# EAGLE design loki_mod (EAGLE 6.6.0)
Pulsar P3 Replacement Module 'Odin' made by Roy Schneider 2020
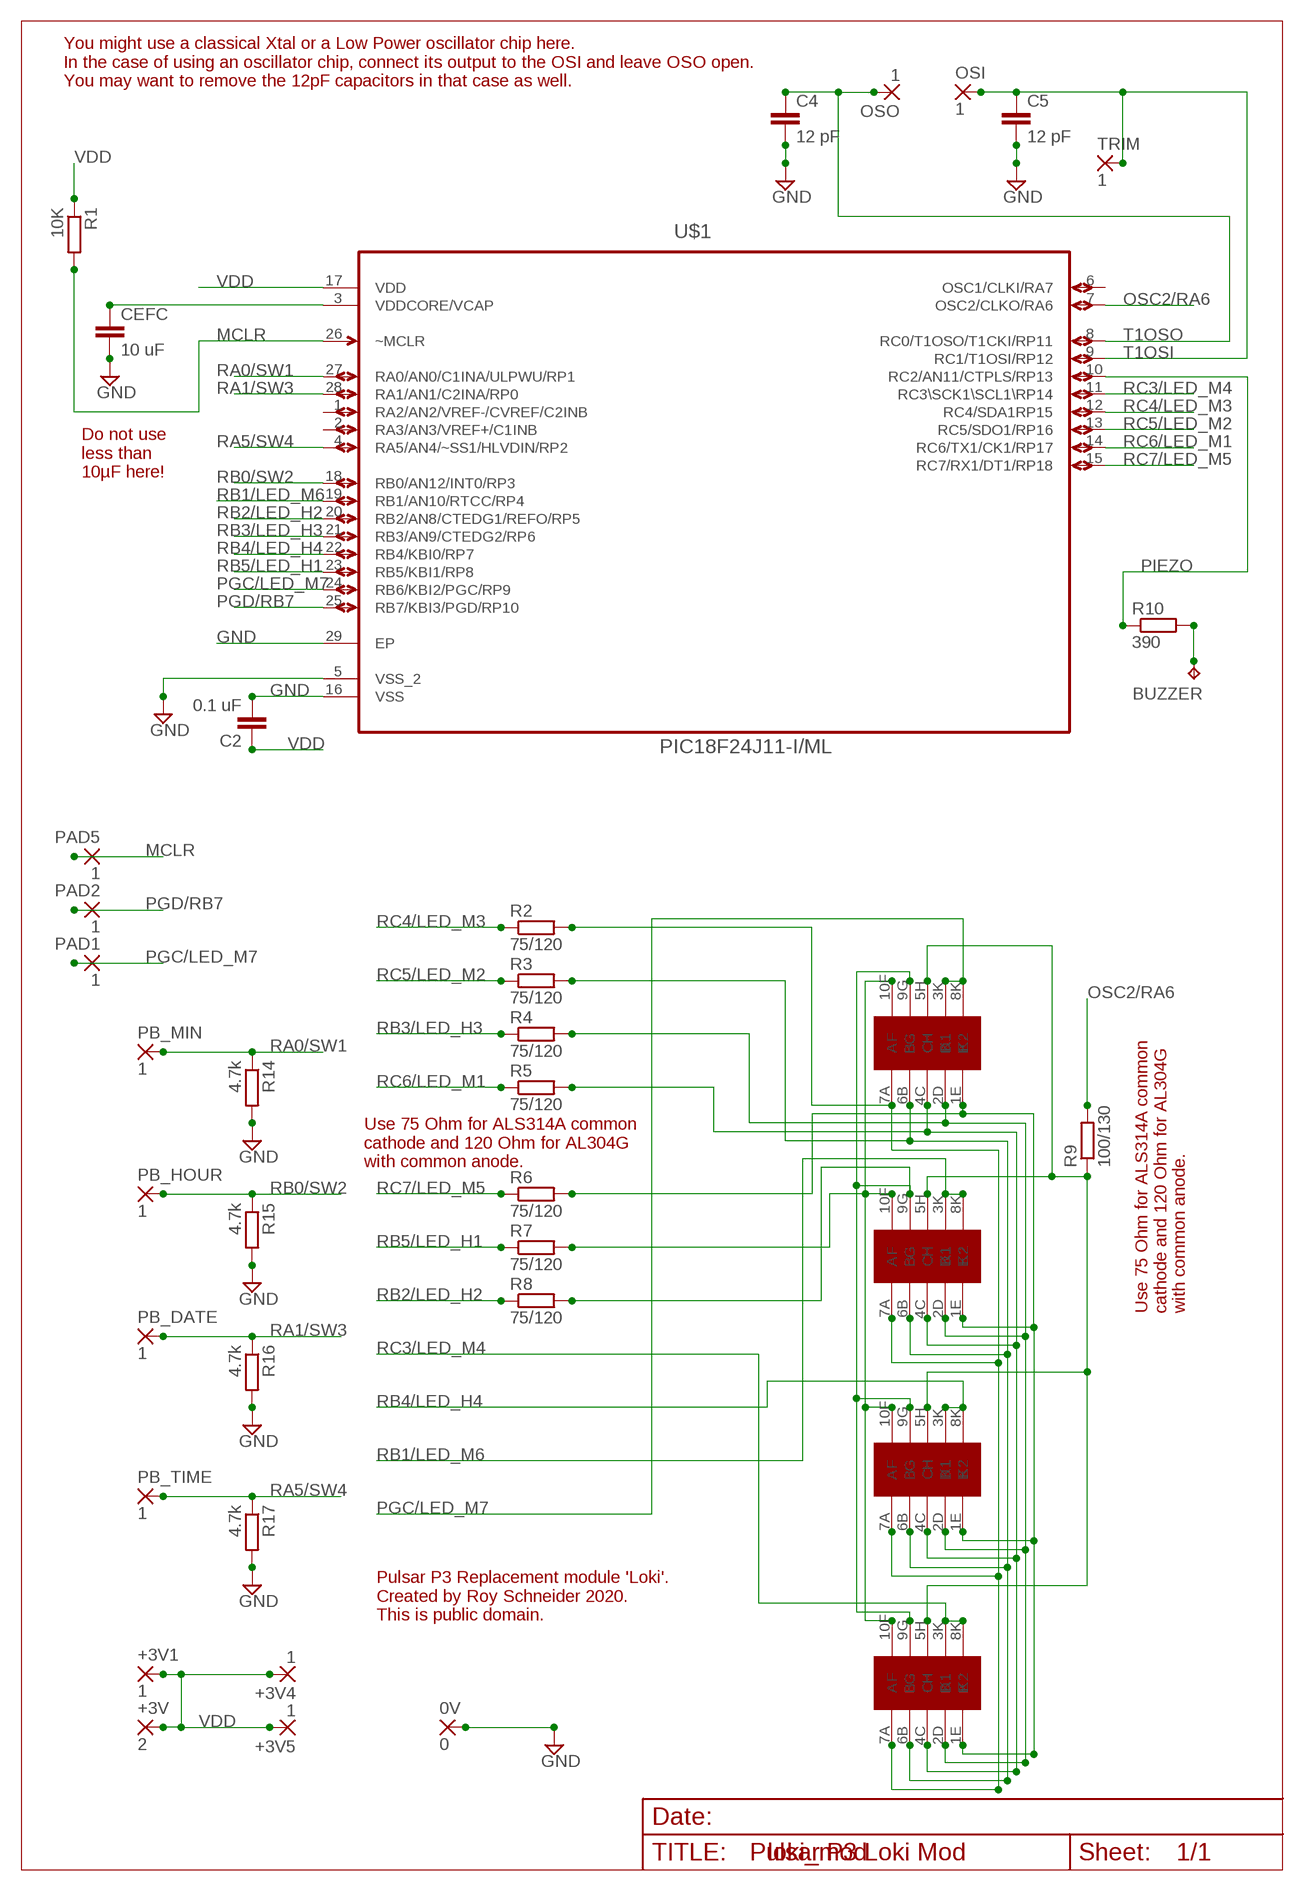
[diagram p0: schematic, sheet 1]

## Parts
0V  0  SMD2  [SMD1,27-2,54]
1H  L104G  [L104G]
1M  L104G  [L104G]
10H  L104G  [L104G]
10M  L104G  [L104G]
+3V  2  SMD2  [SMD1,27-2,54]
+3V1  1  SMD2  [SMD1,27-2,54]
+3V4  1  SMD2  [SMD1,27-2,54]
+3V5  1  SMD2  [SMD1,27-2,54]
BUZZER  TPTP06SQ  [TP06SQ]
C2  0.1 uF  C-EUC0603  [C0603]
C4  12 pF  C-EUC0603  [C0603]
C5  12 pF  C-EUC0603  [C0603]
CEFC  10 uF  C-EUC0603  [C0603]
OSI  1  SMD2  [SMD1,27-2,54]
OSO  1  SMD2  [SMD1,27-2,54]
PAD1  1  SMD2  [SMD1,27-2,54]
PAD2  1  SMD2  [SMD1,27-2,54]
PAD5  1  SMD2  [SMD1,27-2,54]
PB_DATE  1  SMD2  [SMD1,27-2,54]
PB_HOUR  1  SMD2  [SMD1,27-2,54]
PB_MIN  1  SMD2  [SMD1,27-2,54]
PB_TIME  1  SMD2  [SMD1,27-2,54]
R1  10K  R-EU_R0402  [R0402]
R2  75/120  R-EU_R0402  [R0402]
R3  75/120  R-EU_R0402  [R0402]
R4  75/120  R-EU_R0402  [R0402]
R5  75/120  R-EU_R0402  [R0402]
R6  75/120  R-EU_R0402  [R0402]
R7  75/120  R-EU_R0402  [R0402]
R8  75/120  R-EU_R0402  [R0402]
R9  100/130  R-EU_R0402  [R0402]
R10  390  R-EU_R0402  [R0402]
R14  4.7k  R-EU_R0402  [R0402]
R15  4.7k  R-EU_R0402  [R0402]
R16  4.7k  R-EU_R0402  [R0402]
R17  4.7k  R-EU_R0402  [R0402]
TRIM  1  SMD2  [SMD1,27-2,54]
U$1  PIC18F24J11-I/ML  [QFN65P600X600X100-29N]

## Nets
GND: 0V.1(P) C2.2 C4.2 C5.2 CEFC.2 R14.2 R15.2 R16.2 R17.2 U$1.5(VSS_2) U$1.16(VSS) U$1.29(EP)
MCLR: PAD5.1(P) R1.2 U$1.26(~MCLR)
N$1: BUZZER.TP R10.2
N$2: 1H.10F(F) 1M.10F(F) 10H.10F(F) 10M.10F(F) R7.2
N$3: 1H.9G(G) 1M.9G(G) 10H.9G(G) 10M.9G(G) R8.2
N$6: 1H.5H(H) 1M.5H(H) 10H.5H(H) 10M.5H(H) R9.1
N$7: 1H.2D(D) 1M.2D(D) 10H.2D(D) 10M.2D(D) R4.2
N$8: 1H.1E(E) 1M.1E(E) 10H.1E(E) 10M.1E(E) R6.2
N$9: 1H.7A(A) 1M.7A(A) 10H.7A(A) 10M.7A(A) R2.2
N$10: 1H.6B(B) 1M.6B(B) 10H.6B(B) 10M.6B(B) R3.2
N$13: 1H.4C(C) 1M.4C(C) 10H.4C(C) 10M.4C(C) R5.2
OSC2/RA6: R9.2 U$1.7(OSC2/CLKO/RA6)
PGC/LED_M7: 10H.3K(K1) 10H.8K(K2) PAD1.1(P) U$1.24(RB6/KBI2/PGC/RP9)
PGD/RB7: PAD2.1(P) U$1.25(RB7/KBI3/PGD/RP10)
PIEZO: R10.1 U$1.10(RC2/AN11/CTPLS/RP13)
RA0/SW1: PB_MIN.1(P) R14.1 U$1.27(RA0/AN0/C1INA/ULPWU/RP1)
RA1/SW3: PB_DATE.1(P) R16.1 U$1.28(RA1/AN1/C2INA/RP0)
RA5/SW4: PB_TIME.1(P) R17.1 U$1.4(RA5/AN4/~SS1/HLVDIN/RP2)
RB0/SW2: PB_HOUR.1(P) R15.1 U$1.18(RB0/AN12/INT0/RP3)
RB1/LED_M6: 1H.3K(K1) 1H.8K(K2) U$1.19(RB1/AN10/RTCC/RP4)
RB2/LED_H2: R8.1 U$1.20(RB2/AN8/CTEDG1/REFO/RP5)
RB3/LED_H3: R4.1 U$1.21(RB3/AN9/CTEDG2/RP6)
RB4/LED_H4: 10M.3K(K1) 10M.8K(K2) U$1.22(RB4/KBI0/RP7)
RB5/LED_H1: R7.1 U$1.23(RB5/KBI1/RP8)
RC3/LED_M4: 1M.3K(K1) 1M.8K(K2) U$1.11(RC3\SCK1\SCL1\RP14)
RC4/LED_M3: R2.1 U$1.12(RC4/SDA1RP15)
RC5/LED_M2: R3.1 U$1.13(RC5/SDO1/RP16)
RC6/LED_M1: R5.1 U$1.14(RC6/TX1/CK1/RP17)
RC7/LED_M5: R6.1 U$1.15(RC7/RX1/DT1/RP18)
T1OSI: C5.1 OSI.1(P) TRIM.1(P) U$1.9(RC1/T1OSI/RP12)
T1OSO: C4.1 OSO.1(P) U$1.8(RC0/T1OSO/T1CKI/RP11)
VDD: +3V1.1(P) +3V4.1(P) +3V5.1(P) +3V.1(P) C2.1 R1.1 U$1.17(VDD)
VDDCORE/VCAP: CEFC.1 U$1.3(VDDCORE/VCAP)
Unconnected: U$1.1(RA2/AN2/VREF-/CVREF/C2INB) U$1.2(RA3/AN3/VREF+/C1INB) U$1.6(OSC1/CLKI/RA7)

## Notes on the sheet
- You might use a classical Xtal or a Low Power oscillator chip here.
  In the case of using an oscillator chip, connect its output to the OSI and leave OSO open.
  You may want to remove the 12pF capacitors in that case as well.
- Do not use
  less than
  10µF here!
- Use 75 Ohm for ALS314A common
  cathode and 120 Ohm for AL304G
  with common anode.
- Use 75 Ohm for ALS314A common
  cathode and 120 Ohm for AL304G
  with common anode.
- Pulsar P3 Replacement module 'Loki'.
  Created by Roy Schneider 2020.
  This is public domain.
- Pulsar P3 Loki Mod

## Library data of the parts
0V +3V +3V1 +3V4 +3V5 OSI OSO PAD1 PAD2 PAD5 PB_DATE PB_HOUR PB_MIN PB_TIME TRIM = wirepad:SMD2: SMD PAD
1H 1M 10H 10M = l104g:L104G
BUZZER = testpad:TP: Test pad
C2 C4 C5 CEFC = resistor:C-EU: CAPACITOR, European symbol
R1 = rcl:R-EU_: RESISTOR, European symbol
R2-R10 R14-R17 = resistor:R-EU_: RESISTOR, European symbol
U$1 = pic18f24j11:PIC18F24J11-I/ML: 8BIT MCU; DESCRIPTION: 8BIT MCU; MPN: PIC18F24J11-I/Ml; OC_FARNELL: 1707634; OC_NEWARK: 98M1764; PACKAGE: QFN-28; SUPPLIER: Microchip

## Net classes
0 default: clearance 0.205 mm

## Board
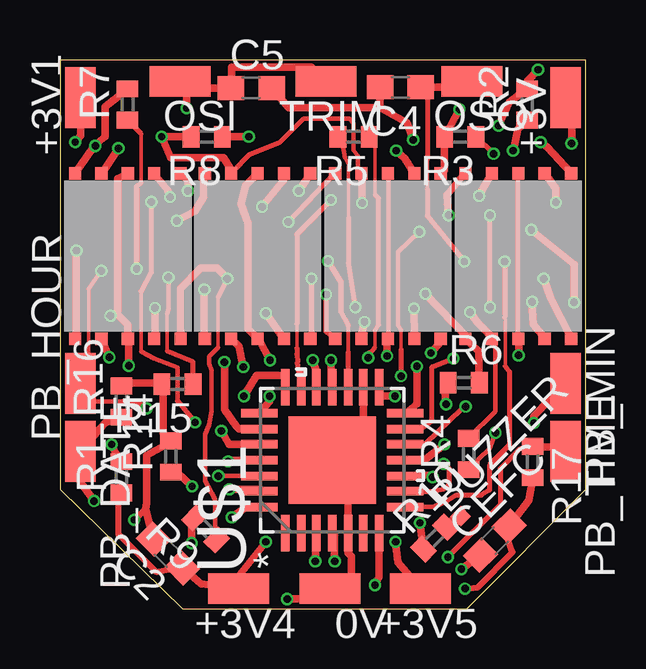
[diagram p1: board, top side]
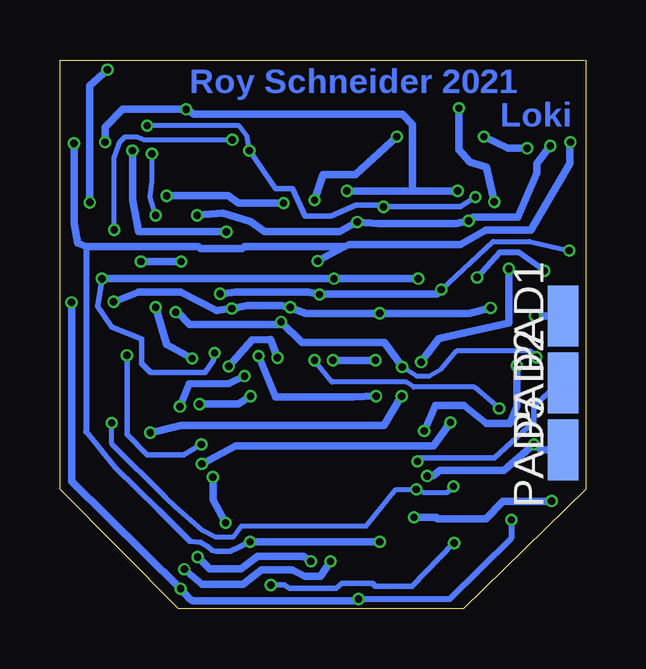
[diagram p2: board, bottom side, seen from below]

Size 21.92 x 22.89 mm. Coordinates in mm from the lower left corner, seen from the top.
Outline: 0.03,22.89 21.92,22.89 21.92,4.98 16.97,0 5.11,0 0,4.98 0,22.89
Copper layers (1*16): Top 0.035mm / dielectric 1.5mm / Bottom 0.035mm
Design rules "default *": minimum track width 6mil, minimum drill 12mil, track to track 4mil, track to pad 4mil, pad to pad 4mil, via to via 4mil, smd to smd 4mil, copper to edge 5mil, drill to drill 8mil, minimum pad ring 5mil, minimum via ring 4mil, stop-mask expansion 4mil, vias tented up to drill 0mil, thermal gap 5mil

### Footprints (pad centres in the part's own frame; a part is rotated, then mirrored left to right if it is on the bottom)
SMD1,27-2,54 = smd 1.27 x 2.54: 1 0,0
L104G = smd 0.508 x 0.508: 1E 0.3,-0.3; 2D 1.4,-0.3; 3K 2.5,-0.3; 4C 3.6,-0.3; 5H 4.7,-0.3; 6B 4.7,6.6; 7A 3.6,6.6; 8K 2.5,6.6; 9G 1.4,6.6; 10F 0.3,6.6
TP06SQ = smd 0.6 x 0.6: TP 0,0
C0603 = smd 1.1 x 1: 1 -0.85,0; 2 0.85,0
R0402 = smd 0.7 x 0.9: 1 -0.65,0; 2 0.65,0
QFN65P600X600X100-29N = smd 1.524 x 0.356: 1 -3.048,1.956; 2 -3.048,1.295; 3 -3.048,0.66; 4 -3.048,0; 5 -3.048,-0.66; 6 -3.048,-1.295; 7 -3.048,-1.956; 15 3.048,-1.956; 16 3.048,-1.295; 17 3.048,-0.66; 18 3.048,0; 19 3.048,0.66; 20 3.048,1.295; 21 3.048,1.956 | smd 0.356 x 1.524: 8 -1.956,-3.048; 9 -1.295,-3.048; 10 -0.66,-3.048; 11 0,-3.048; 12 0.66,-3.048; 13 1.295,-3.048; 14 1.956,-3.048; 22 1.956,3.048; 23 1.295,3.048; 24 0.66,3.048; 25 0,3.048; 26 -0.66,3.048; 27 -1.295,3.048; 28 -1.956,3.048 | smd 3.658 x 3.658: 29 0,0

### Placement (x,y rotation side)
0V  11.25,0.84 90 top
1H  5.74,11.56 0 top
1M  16.61,11.56 0 top
10H  0.33,11.56 0 top
10M  11.18,11.56 0 top
+3V  21.08,21.31 0 top
+3V1  0.86,21.31 0 top
+3V4  7.44,0.84 90 top
+3V5  15.04,0.84 90 top
BUZZER  16.71,3.86 45 top
C2  4.5,2.31 135 top
C4  14.2,21.74 180 top
C5  7.98,21.72 0 top
CEFC  18.14,2.84 45 top
OSI  5,22 90 top
OSO  17.17,22 90 top
PAD1  0.94,12.22 0 bottom
PAD2  0.94,9.42 0 bottom
PAD5  0.94,6.63 0 bottom
PB_DATE  0.86,6.55 180 top
PB_HOUR  0.86,9.4 0 top
PB_MIN  21.08,9.4 180 top
PB_TIME  21.08,6.55 180 top
R1  2.57,5.49 90 top
R2  19.48,21.03 90 top
R3  16.69,19.68 180 top
R4  17.04,6.45 90 top
R5  12.24,19.68 180 top
R6  16.84,9.42 0 top
R7  2.82,21.03 90 top
R8  6.12,19.68 180 top
R9  6.07,3.33 135 top
R10  15.62,2.95 45 top
R14  4.62,6.35 90 top
R15  4.9,9.37 180 top
R16  2.57,8.64 90 top
R17  19.71,6.12 270 top
TRIM  11.1,22 90 top
U$1  11.35,6.2 90 top

### Tracks (layer width: path | path; a pad name or v marks a point on that pad's centre or on a via)
GND  (via drill 0.3)
  Top 0.152: 12.65,9.04 U$1.16 | 12.65,7.29 U$1.29 12.01,5.79 | 4.24,9.37 R15.2 4.29,9.27 | R14.2 4.6,6.93 | C2.2 | 8.84,21.72 C5.2 | C4.2 | R17.2 | 18.75,3.45 CEFC.2 18.72,3.38 18.57,3.23 | 11.2,0.79 0V.1 | 12.01,3.4 U$1.5
  Top 0.254: 18.57,3.23 18.87,2.36 17.42,0.89 v16.89,0.84 | v3.1,3.71 3.19,3.78 3.57,4.16
  Top 0.305: 12.65,7.29 12.65,9.04 | 4.24,9.37 4.14,9.42 2.54,9.42 R16.2 | R14.2 4.29,7.34 4.29,9.27 | C2.2 3.57,4.16 3.61,4.39 3.61,6.4 4.6,6.93 | 8.84,21.72 9.53,20.9 13.34,20.9 | C4.2 13.34,20.9 | R17.2 19.56,4.52 18.75,3.45 | 0V.1 12.14,1.02 12.17,1.4 12.17,2.18 12.01,2.34 U$1.5 | v9.47,0.41 10.46,0.41 11.2,0.79 | 13.34,20.9 14.48,20.27 v14.73,19.56 | v19.66,15.8 21.44,14.35 v21.44,12.78 | 12.01,3.4 12.01,5.79
  Bottom 0.152: 16.87,0.84 v16.89,0.84
  Bottom 0.203: v19.66,15.8 19.66,18.82 19.48,19.33 19.41,19.48 19.2,19.69 18.72,19.69 18.42,19.56 v14.73,19.56
  Bottom 0.254: v9.47,0.41 5.66,0.41 3.1,2.95 v3.1,3.71
  Bottom 0.305: v21.44,12.78 21.44,5.31 v16.89,0.84 16.51,0.41 16.38,0.33 9.55,0.33 v9.47,0.41
MCLR  (via drill 0.3)
  Top 0.152: 2.57,6.15 R1.2
  Top 0.178: 6.76,5.54 U$1.26
  Top 0.203: v6.6,5.54 6.76,5.54
  Top 0.305: 2.57,6.15 2.31,6.53 v2.16,6.86
  Bottom 0.305: PAD5.1 1.83,6.63 v2.16,6.86 3.4,5.77 6.07,5.77 6.38,5.54 v6.6,5.54
N$1
  Top 0.508: R10.2 BUZZER.TP
N$2  (via drill 0.3)
  Top 0.152: 10H.10F | 2.82,21.67 R7.2 | 6.02,18.14 1H.10F | 11.46,18.14 10M.10F | 16.89,18.16 1M.10F
  Top 0.203: v9.53,16.13 11.46,18.14
  Top 0.305: 1.47,19.35 1.88,19.69 1.88,20.93 2.82,21.67 | 1.47,19.35 10H.10F | 6.02,18.14 5.99,17.88 5.99,17.17 5.64,16.59 v4.88,16.18 | v1.47,19.3 1.47,19.35 | 16.89,18.16 16.13,17.25 v16.21,16.41
  Bottom 0.305: v1.47,19.3 2.03,18.57 2.03,18.16 2.82,16.33 4.67,16.33 v4.88,16.18 5.38,16.05 8.64,16.05 v9.53,16.13 10.26,15.72 13.39,15.72 13.97,16.15 15.11,16.51 v16.21,16.41
N$3  (via drill 0.3)
  Top 0.152: 1.75,18.16 10H.9G | 5.46,19.69 R8.2 | 1H.9G 7.19,18.21 | 12.42,18.31 10M.9G 12.6,18.08 | 1M.9G
  Top 0.178: 12.42,18.31 12.42,18.87 12.24,19.13 12.24,20.24 12.07,20.45 10.16,20.45 9.17,19.46
  Top 0.203: 7.19,18.21 7.92,18.95 9.17,19.46
  Top 0.305: v2.44,19.2 1.75,18.16 | 5.46,19.69 v4.24,19.69 4.62,18.82 6.83,18.82 7.19,18.21 | v17.48,17.22 1M.9G | 12.6,18.08 v12.6,16.92
  Bottom 0.305: v4.24,19.69 3.25,19.2 v2.44,19.2 | v12.6,16.92 14.48,16.92 14.91,17.22 v17.48,17.22
N$6  (via drill 0.3)
  Top 0.152: 10.46,11.28 1H.5H | 21.31,11.3 1M.5H | 6.48,2.92 R9.1 | 6.6,13 6.6,10.9
  Top 0.178: 6.48,2.92 6.48,4.57 6.05,5.33 6.05,7.26 6.22,7.67 6.32,8.26 6.32,9.93 6.22,10.24 6.22,10.52 6.6,10.9 | v6.99,13.77 6.6,13 | R9.1
  Top 0.229: 10.46,11.28 10.49,11.43 v10.49,13.77
  Top 0.305: v20.17,13.77 20.47,12.93 21.31,11.3 | 10H.5H 5.03,13.36 5.87,14.2 6.55,14.2 v6.99,13.77 | 10M.5H 15.88,11.15 v15.47,10.67
  Bottom 0.229: v15.47,10.67 15.54,10.34 15.88,9.86 18.14,9.86 18.52,10.24 18.52,11.25 19.76,11.76 20.35,12.6 v20.17,13.77
  Bottom 0.305: v20.17,13.77 v10.49,13.77 v6.99,13.77
N$7  (via drill 0.3)
  Top 0.152: 18.16,11.18 18.03,11.28 1M.2D 17.98,11.35 | 7.16,11.25 1H.2D | 12.55,11.35 12.6,11.28 10M.2D
  Top 0.178: 18.16,11.18 18.16,8.23 17.02,7.11 R4.2
  Top 0.305: v7.65,10.08 7.47,10.95 7.16,11.25 | v12.7,11.96 12.55,11.35 | 17.98,11.35 17.42,11.91 v17.09,12.37 | 10H.2D v2.06,10.49
  Bottom 0.152: 12.75,11.94 v12.7,11.96
  Bottom 0.203: v7.65,10.08 7.04,9.7 6.53,9.7 6.02,10.01 5.38,10.74 2.29,10.74 v2.06,10.49
  Bottom 0.305: v7.65,10.08 8.38,11.1 11.84,11.1 v12.7,11.96 12.85,11.86 16.51,11.86 17.02,12.37 v17.09,12.37
N$8  (via drill 0.3)
  Top 0.152: 17.48,9.47 R6.2 | 0.64,11.28 10H.1E | 6.02,11.28 1H.1E | 16.99,11.3 1M.1E
  Top 0.229: 10M.1E 11.1,11.58 v11.1,13.11
  Top 0.305: 1M.1E 17.48,10.72 17.48,9.47 | 0.64,11.28 0.69,11.33 v0.69,14.94 | 6.02,11.28 v6.02,13.31 | v15.24,13.13 16.99,11.3
  Bottom 0.152: 11.13,13.13 v11.1,13.11 11.2,13.13
  Bottom 0.203: v0.69,14.94 2.34,15.32 3.86,15.32 v6.02,13.31
  Bottom 0.305: 11.13,13.13 6.2,13.13 v6.02,13.31 | 11.2,13.13 11.56,13.21 14.61,13.21 v15.24,13.13
N$9  (via drill 0.3)
  Top 0.152: R2.2 19.48,22 | 1M.7A | 3.94,18.14 10H.7A | 9.32,18.14 1H.7A | 14.76,18.16 10M.7A
  Top 0.305: 1M.7A 20.68,17.53 v20.68,16.94 | 19.48,22 v19.94,22.48 | 3.94,18.14 4.5,17.45 v4.6,17.17 | v8.43,16.76 9.32,17.88 9.32,18.14 | 14.76,18.16 14.38,18.77 v14.02,19.1 | v18.29,20.14 18.64,20.9 18.75,21.13 R2.2
  Bottom 0.203: v18.29,20.14 14.45,20.14 14.12,19.71 v14.02,19.1 | 8.51,16.69 v8.43,16.76
  Bottom 0.229: v4.6,17.17 5.23,16.76 v8.43,16.76 8.51,16.84 9.58,16.84 10.62,16.38 11.71,16.38 12.22,17.53 12.93,17.53 v14.02,19.1
  Bottom 0.305: v20.68,16.94 20.68,21.82 v19.94,22.48
N$10  (via drill 0.3)
  Top 0.152: 5.05,18.14 10H.6B | 10.44,18.14 1H.6B | 15.9,18.16 10M.6B | 16.03,19.74 R3.2 16.1,19.76 | 21.31,18.19 1M.6B
  Top 0.305: 5.05,18.14 5.33,17.86 v5.33,17.42 | 10.44,18.14 v9.96,17.42 | 15.9,18.16 16.03,18.29 16.03,19.74 | 21.31,18.19 20.32,19.25 v20.04,19.46 | 16.1,19.76 v16.66,20.83
  Bottom 0.305: v9.96,17.42 7.21,17.42 | 7.21,17.42 v5.33,17.42 | 7.21,17.42 7.21,20.19 7.65,20.62 16.33,20.62 v16.66,20.83 19.3,20.83 20.04,20.09 v20.04,19.46
N$13  (via drill 0.3)
  Top 0.152: 3.96,11.3 3.94,11.28 10H.4C | 9.32,11.28 1H.4C | 14.78,11.3 14.76,11.28 10M.4C | 20.19,11.3 1M.4C | 11.76,19.48 11.61,19.69 R5.2 | 11.89,18.82 12.04,18.52 12.04,16.31
  Top 0.178: 11.89,18.82 11.76,19.48
  Top 0.203: v12.32,12.57 12.04,14.48 12.04,16.31
  Top 0.305: v3.96,12.55 3.96,11.3 | 9.32,11.28 v8.59,12.32 | v14.76,12.52 14.78,11.3 | 20.19,11.3 19.74,11.86 v19.69,12.8
  Bottom 0.152: 14.66,12.55 v14.76,12.52 | v12.32,12.57 12.29,12.55
  Bottom 0.305: v3.96,12.55 4.88,12.32 v8.59,12.32 11.66,12.32 12.29,12.55 12.67,12.65 14.1,12.65 v14.76,12.52 14.55,12.55 | v19.69,12.8 18.64,13.21 16.89,13.21 15.39,12.45 14.66,12.55
OSC2/RA6  (via drill 0.3)
  Top 0.152: 5.49,3.68 5.59,3.78 R9.2
  Top 0.305: v5.49,2.74 5.49,3.68 | v13.13,0.99 13.31,1.32 U$1.7
  Bottom 0.229: v5.49,2.74 7.24,0.94 8.76,0.94 8.89,1.07 10.16,1.07 10.41,0.86 12.34,0.86 12.57,0.99 v13.13,0.99
PGC/LED_M7  (via drill 0.3)
  Top 0.152: 2.82,11.28 10H.3K 2.87,11.2 | 2.82,18.14 10H.8K
  Top 0.305: 2.82,11.28 2.82,11.86 2.41,12.27 | 2.41,12.27 2.41,17.93 2.82,18.14 | U$1.24 7.06,6.86 v6.73,7.42 | 2.87,11.2 v2.87,10.13 | v2.11,12.22 2.41,12.27
  Bottom 0.305: v6.73,7.42 6.27,8.48 5.08,8.48 4.14,7.72 3.15,7.72 2.87,8.43 v2.87,10.13 | v2.11,12.22 PAD1.1
PGD/RB7  (via drill 0.3)
  Top 0.305: U$1.25 7.01,6.2 v7.01,6.15
  Bottom 0.203: 6.86,6.3 v7.01,6.15
  Bottom 0.229: 6.86,6.3 3.81,6.3 2.16,7.8 2.16,8.41 1.14,9.42 PAD2.1
PIEZO  (via drill 0.3)
  Top 0.305: U$1.10 15.47,5.59 v15.54,5.49 | R10.1 v15.01,3.58
  Bottom 0.305: v15.01,3.58 15.54,4.55 v15.54,5.49
RA0/SW1  (via drill 0.3)
  Top 0.152: U$1.27 8.31,4.98 | 4.62,5.69 R14.1
  Top 0.305: 4.62,5.69 4.88,5.69 v5.51,5.11 | 8.31,4.98 v7.06,4.98 | PB_MIN.1 19.76,8.05 v19.76,7.75
  Bottom 0.203: 5.64,4.98 v5.51,5.11 5.77,4.85 6.76,4.85 7.01,4.98 v7.06,4.98 7.9,4.98 9.14,3.45 14.35,3.45 14.68,3 15.44,3 15.98,3.28 17.12,4.27 17.5,4.62 19.76,6.88 v19.76,7.75
RA1/SW3  (via drill 0.3)
  Top 0.152: 2.57,8 R16.1 | 0.84,6.58 PB_DATE.1
  Top 0.305: 2.57,8 1.91,7.77 1.68,7.52 PB_DATE.1 | U$1.28 7.8,4.27 v7.16,3.81 | v1.42,4.5 0.84,5.28 0.84,6.58
  Bottom 0.305: v1.42,4.5 1.42,4.47 3.45,4.47 4.17,3.76 6.17,3.76 6.22,3.81 v7.16,3.81
RA5/SW4  (via drill 0.3)
  Top 0.152: 19.71,6.76 R17.1 | 11.46,3.1 U$1.4 | 19.66,6.71 R17.1 | 19.62,6.68 R17.1
  Top 0.203: v16.18,2.16 18.36,4.34 18.36,5.84 19.2,6.68 19.62,6.68
  Top 0.305: 19.71,6.76 21.13,6.76 PB_TIME.1 | v11.46,1.98 11.46,3.1
  Bottom 0.305: v11.46,1.98 11.76,2.18 13.69,2.18 14.38,1.68 15.67,1.68 v16.18,2.16
RB0/SW2  (via drill 0.3)
  Top 0.152: 4.47,12.29 4.47,10.74 | 1.19,13.34 1.19,9.8 PB_HOUR.1 0.84,8.64 | 11.3,9.35 U$1.18
  Top 0.178: 4.47,10.74 5.54,10.31 | 4.47,12.29 4.52,12.52 v4.52,13.82 | 1.19,13.34 v1.73,14.1 | 3.35,8.56 3.12,8.64 0.84,8.64
  Top 0.203: 5.54,10.31 5.54,9.37 R15.1 | 3.35,8.56 v3.61,8.36
  Top 0.305: v11.3,10.36 11.3,9.35
  Bottom 0.203: v11.3,10.36 10.57,9.45 7.47,9.45 7.16,9.25 4.65,9.25 v3.61,8.36
  Bottom 0.254: v4.52,13.82 3.58,14.86 2.79,14.86 v1.73,14.1
RB1/LED_M6  (via drill 0.3)
  Top 0.152: 8.23,11.28 1H.3K 8.31,11.23 | 8.23,18.14 1H.8K | 10.72,9.86 U$1.19
  Top 0.305: 8.23,11.28 7.85,11.66 7.85,16.05 7.54,16.87 7.75,17.65 8.23,18.14 | v10.54,10.36 10.72,9.86 | 8.31,11.23 v8.76,10.36
  Bottom 0.305: v8.76,10.36 v10.54,10.36
RB2/LED_H2  (via drill 0.3)
  Top 0.152: 9.88,11.89 9.88,10.87
  Top 0.203: v11.3,17.04 9.88,15.62 9.88,11.89 | U$1.20 9.91,10.26 9.88,10.62 9.88,10.87
  Top 0.305: v7.87,19.69 R8.1
  Bottom 0.305: v7.87,19.69 9.6,18.11 10.95,18.11 v11.3,17.04
RB3/LED_H3  (via drill 0.3)
  Top 0.178: v18.16,7.34 17.93,6.68 17.02,5.82 R4.1
  Top 0.305: v7.67,8.86 8.2,9.73 9.4,9.73 U$1.21
  Bottom 0.305: v18.16,7.34 16.87,7.65 8.41,7.65 v7.67,8.86
RB4/LED_H4  (via drill 0.3)
  Top 0.152: 13.69,11.28 10M.3K 13.64,11.2 | 13.69,18.14 10M.8K
  Top 0.178: 13.69,18.14 13.69,11.28
  Top 0.305: U$1.22 8.74,8.64 v8.74,8.86 | 13.64,11.2 v13.64,10.54
  Bottom 0.305: v8.74,8.86 9.7,8.84 12.93,8.84 13.61,10.49 v13.64,10.54
RB5/LED_H1  (via drill 0.3)
  Top 0.152: 3.38,17.78 3.38,19.81 | 2.82,20.37 R7.1
  Top 0.178: 3.2,17.6 3.38,17.78
  Top 0.203: 3.38,19.81 2.82,20.37
  Top 0.229: v3.2,14.17 3.2,17.6
  Top 0.305: v6.86,10.29 6.86,8.31 7.34,7.62 7.47,7.49 U$1.23
  Bottom 0.305: v3.2,14.17 3.2,11.91 6.12,11.28 v6.86,10.29
RC3/LED_M4  (via drill 0.3)
  Top 0.152: 19.1,11.3 1M.3K 19.13,11.23 | 19.1,18.16 1M.8K
  Top 0.178: 19.1,18.16 19.1,11.3
  Top 0.305: 19.13,11.23 v19.13,10.57 | U$1.11 15.27,6.25 v16.03,6.86
  Bottom 0.229: v16.03,6.86 16.76,6.43 18.29,6.43 19.13,7.26 v19.13,10.57
RC4/LED_M3  (via drill 0.3)
  Top 0.152: 19.48,20.37 R2.1 | 14.22,11.63 14.22,10.8
  Top 0.178: v14.99,15.72 14.1,14.88 14.1,11.84 14.22,11.63
  Top 0.203: U$1.12 15.27,6.91 16.74,8.33 v16.92,8.43 | 14.22,10.8 v14.22,9.7
  Top 0.305: 19.48,20.37 19.1,19.99 v18.9,19.1
  Bottom 0.305: v18.9,19.1 18.9,17.04 18.64,15.72 v14.99,15.72 | v14.22,9.7 14.86,9.4 16.54,9.37 v16.92,8.43
RC5/LED_M2  (via drill 0.3)
  Top 0.152: U$1.13 15.09,7.52 | 17.35,19.74 R3.1
  Top 0.178: 17.35,19.67 R3.1
  Top 0.203: v17.93,12.57 v17.93,16.41 | v16.41,10.44 15.52,10.08 15.52,7.82 15.09,7.52 | v18.08,18.97 17.35,19.67
  Bottom 0.203: v17.93,16.41 18.16,17.17 18.08,17.86 v18.08,18.97
  Bottom 0.305: v17.93,12.57 17.48,11.02 v16.41,10.44
RC6/LED_M1  (via drill 0.3)
  Top 0.152: 13.13,17.27 13.13,19.46 R5.1 | 13.13,10.9 13.13,11.61
  Top 0.178: 13.28,17.12 13.13,17.27 | 13.13,11.61 13.28,11.84 | 12.9,10.62 13.13,10.9
  Top 0.203: 13.28,11.84 13.28,17.12
  Top 0.305: v12.85,10.46 12.9,10.62 | v14.88,10.11 14.88,8.53 U$1.14
  Bottom 0.305: v12.85,10.46 13.13,11.23 13.92,11.2 v14.88,10.11
RC7/LED_M5  (via drill 0.3)
  Top 0.152: 16.03,9.32 16.18,9.47 R6.1 | U$1.15 13.31,8.86
  Top 0.305: v16.1,8.53 16.03,9.32 | 13.31,8.86 v13.97,8.86
  Bottom 0.305: v16.1,8.53 14.48,8.53 v13.97,8.86
T1OSI  (via drill 0.3)
  Top 0.152: 5,21.72 OSI.1 5.28,21.67 | 3.38,13.23 3.38,10.72 | 7.16,21.77 C5.1 | 16.26,5.82 v16,6.05
  Top 0.178: 4.9,8.66 4.9,10.06 3.94,10.44 3.38,10.72
  Top 0.203: 4.9,8.66 v5.64,7.77 | 3.38,13.23 3.81,14.02 v3.81,16.97 | U$1.9 15.57,4.9 15.77,4.95 16,5 16.23,5.21 16.23,5.84 v16,6.05
  Top 0.305: 5,21.72 C5.1 | 5.28,21.67 v5.28,20.88 | TRIM.1 10.49,22.58 7.16,22.58 7.16,21.77
  Bottom 0.305: v16,6.05 14.61,6.78 6.35,6.78 v5.64,7.77 | v3.81,16.97 4.14,18.42 4.83,18.62 5.28,19.15 v5.28,20.88
T1OSO  (via drill 0.3)
  Top 0.152: OSO.1 17.17,21.74 | 15.32,21.69 C4.1 | 18.57,10.11 18.57,12.04 18.54,12.17 | 15.32,18.75 15.32,17.5
  Top 0.203: v16.87,14.48 15.32,16.38 15.32,17.5 | U$1.8 15.62,4.27 16.15,4.52 16.54,4.75 17.58,4.75 17.91,4.95 17.91,5.99 18.75,6.83 18.75,9.88 18.57,10.11 | 15.32,21.69 15.32,18.75 | v18.54,14.48 18.54,12.17
  Top 0.305: 17.17,21.74 C4.1
  Bottom 0.305: v16.87,14.48 v18.54,14.48
VDD  (via drill 0.3)
  Top 0.152: 5.08,1.73 C2.1 5.16,1.68 | 7.26,1.12 +3V4.1 | 21.34,21.08 +3V.1
  Top 0.165: 12.03,10.69 12.03,11.81
  Top 0.203: 11.71,12.4 12.03,11.81 | U$1.17 12.04,9.3 12.03,10.69
  Top 0.229: 11.71,13.61 11.71,12.4
  Top 0.254: R1.1 2.44,4.62 2.44,3.1 4.04,1.52 5.08,1.73 | v11.18,14.5 11.71,13.61
  Top 0.305: +3V4.1 5.89,1.04 5.16,1.68 | +3V5.1 14.1,1.93 v14,2.79 | 7.26,1.12 v8.59,2.79 | v21.34,19.41 21.34,21.08 | +3V1.1 0.86,19.74 v0.64,19.46
  Bottom 0.152: 0.66,19.43 v0.64,19.46
  Bottom 0.229: 20.83,7.39 19.61,5.89 17.83,4.14 16.48,2.82 16.05,2.77 15.75,2.59 15.57,2.44 15.39,2.39 14.83,2.39 v14,2.79
  Bottom 0.254: 20.83,15.11 20.83,7.39
  Bottom 0.305: v8.59,2.79 v14,2.79 | 10.06,15.11 v11.18,14.5 | 10.06,15.11 9.86,15.19 5.23,15.19 4.17,15.8 2.29,15.8 0.66,18.57 0.66,19.43 | 10.06,15.11 14.22,15.11 14.33,15.01 16.05,15.01 16.15,15.11 20.83,15.11 21.18,15.24 21.34,16.05 v21.34,19.41
VDDCORE/VCAP  (via drill 0.3)
  Top 0.305: v16.74,1.65 CEFC.1 | U$1.3 v10.64,1.98
  Bottom 0.305: v10.64,1.98 11.05,1.35 11.71,1.35 12.24,1.63 13.51,1.63 14.27,1.02 16,1.02 v16.74,1.65

### Text on the board
Bottom: Roy Schneider 2021 | Loki